# EasyEDA Pro project LEDclock_DCF77-RTC-BAT_ProPrj_2026-05-02.epro

# Schematic Schematic1
Board Name: Board1; Create Date: 2026-04-27; Page Name: P1; Project Name: LEDclock_DCF77-RTC-BAT; Schematic Name: Schematic1; Update Date: 2026-04-29; Company: EasyEDA.com; Page Size: A4; Version: V1.0
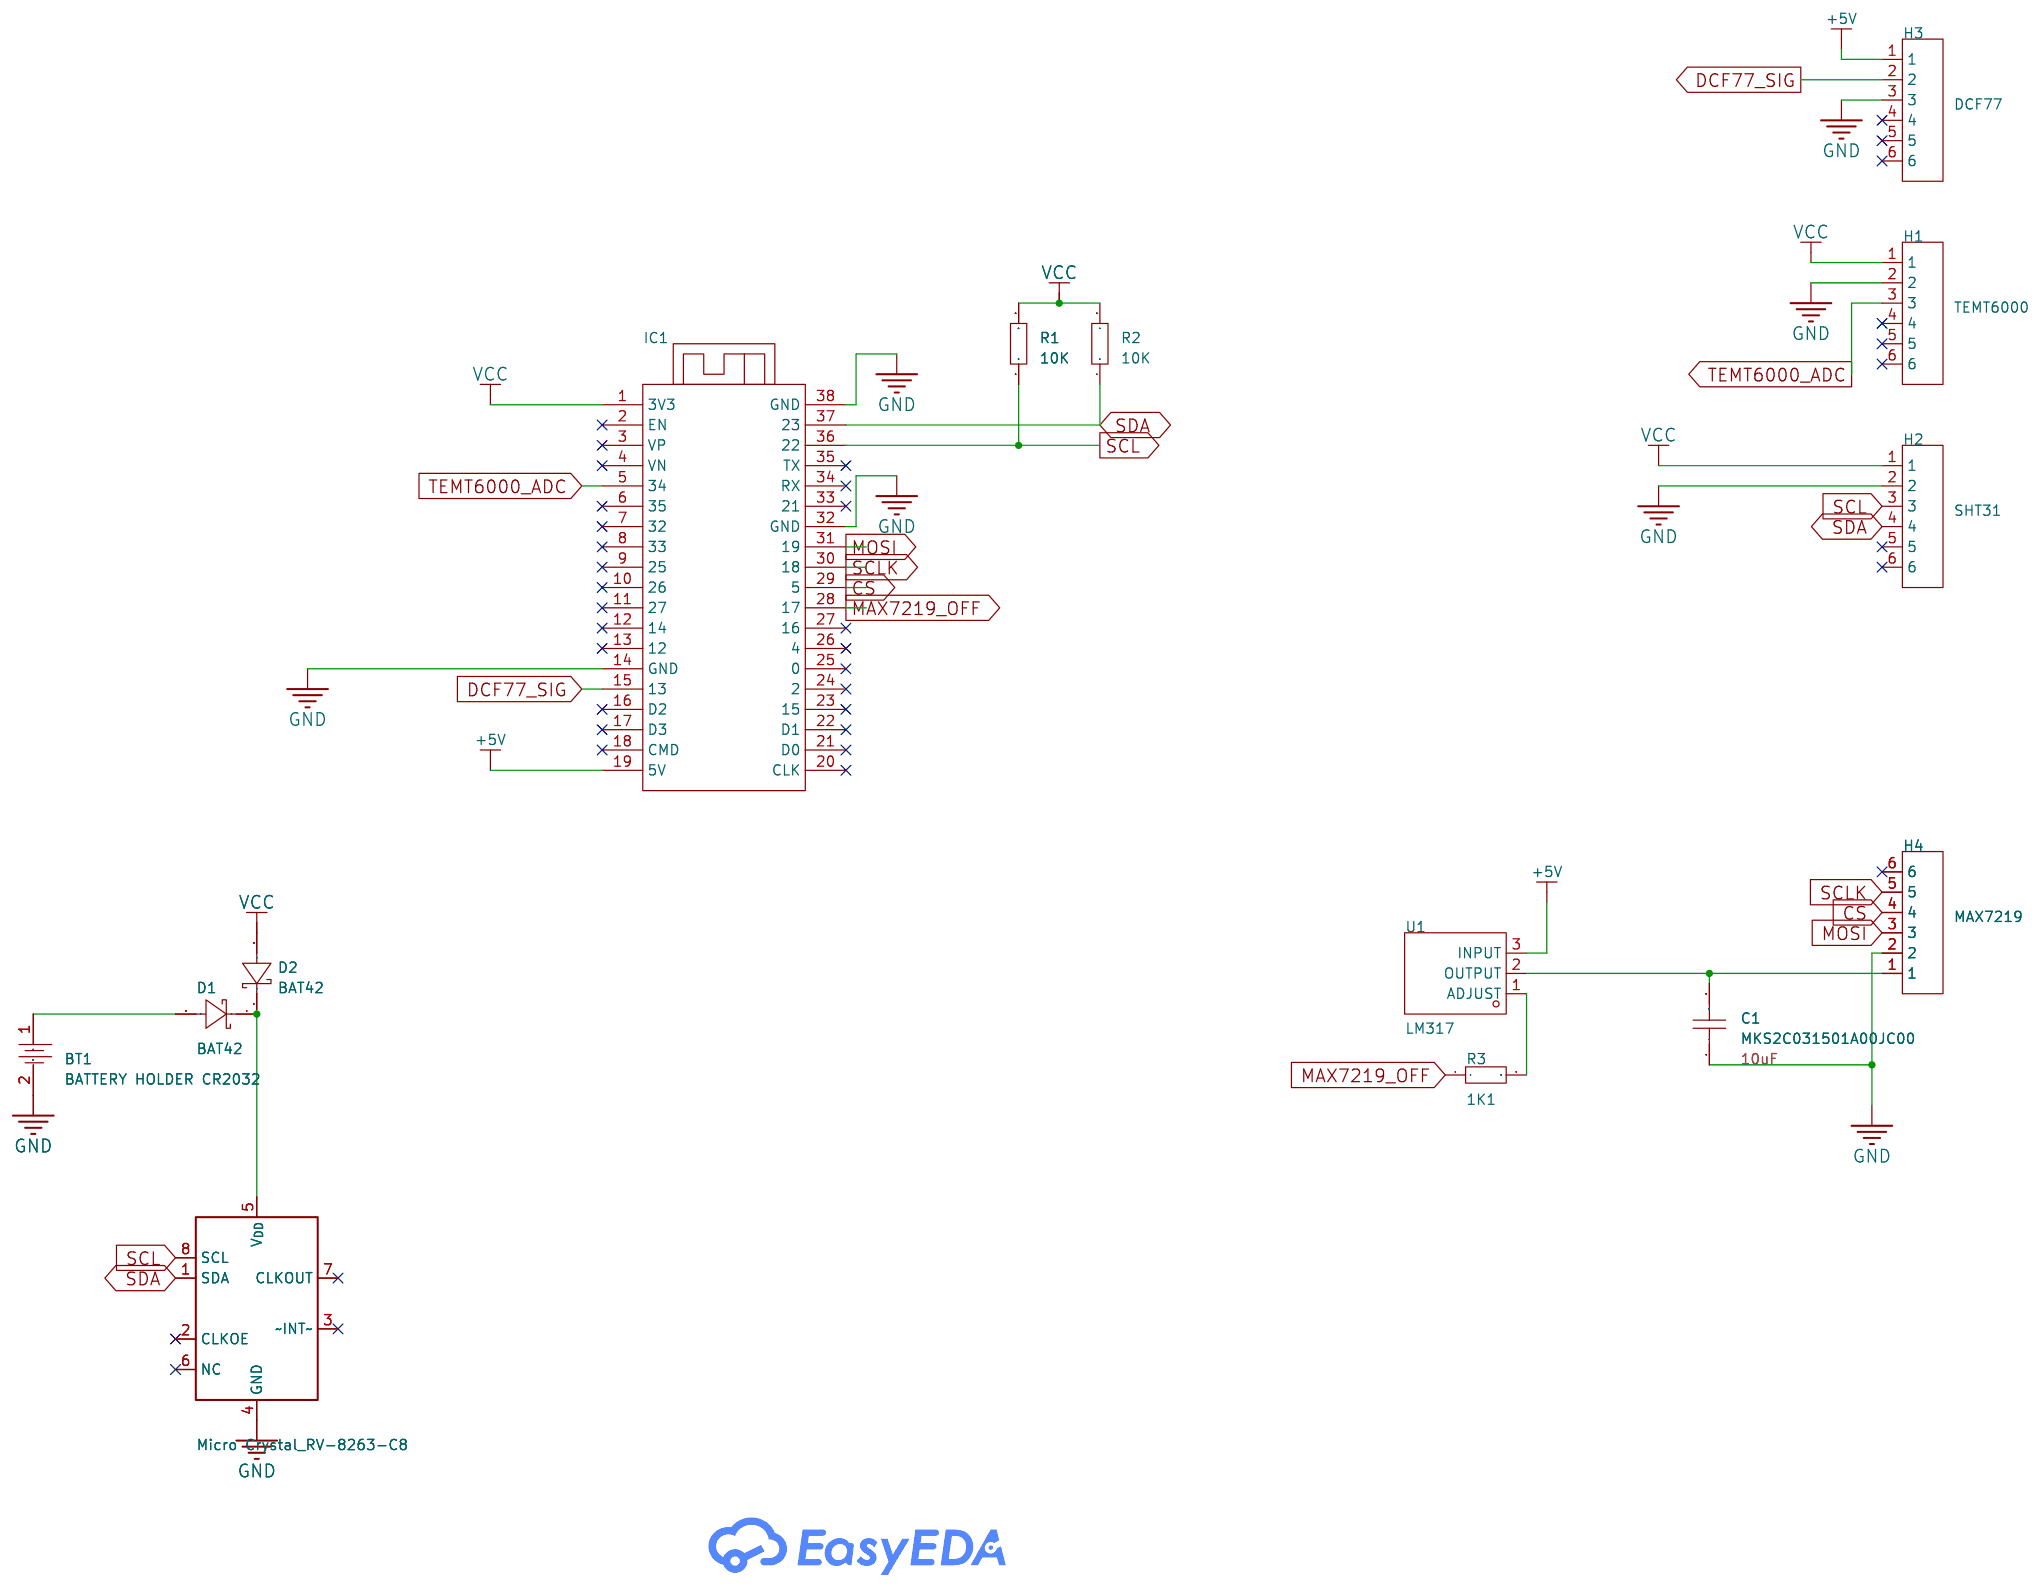
[diagram p0: schematic sheet]

## Parts
BT1  BATTERY HOLDER CR2032  [BAT-TH_FBA25014-S02B2004K]
C1  MKS2C031501A00JC00  [CAP-TH_L7.2-W2.5-P5.00-D0.5-1]
D1  BAT42  [DO-35_BD1.8-L4.1-P7.00-D0.5-RD]
D2  BAT42  [DO-35_BD1.8-L4.1-P7.00-D0.5-RD]
H1  TEMT6000  [CONN-TH_SSQ-106-03-G-S]
H2  SHT31  [CONN-TH_SSQ-106-03-G-S]
H3  DCF77  [CONN-TH_SSQ-106-03-G-S]
H4  MAX7219  [CONN-TH_SSQ-106-03-G-S]
IC1  -  [ESP32 WROOM devkit]
IC2  RV-8263-C8  [Micro Crystal:RV-8263-C8]
R1  10K  [HDR-TH_2P-P5.08_12251103CNSNU000001]
R2  10K  [HDR-TH_2P-P5.08_12251103CNSNU000001]
R3  1K1  [HDR-TH_2P-P5.08_12251103CNSNU000001]
U1  LM317  [TO-220-3_L9.9-W4.5-P2.54-L-1]

## Library data of the parts
BT1 = FBA25014-S02B2004K: Connector Type:Battery Holder Battery Type:- Operating Temperature:-40℃~+85℃ Operating Temperature:-40℃~+85℃; Supplier Part: C2833828; Manufacturer: TXGA(特思嘉); Supplier Footprint: 插件; JLCPCB Part Class: Extended Part; Datasheet: https://item.szlcsc.com/datasheet/FBA25014-S02B2004K/2995292.html; Supplier: LCSC; Connector Type: Battery Holder; Operating Temperature: -40℃~+85℃
C1 = MKS2C031501A00JC00: Supplier Part: C7420631; Manufacturer: WIMA; Supplier Footprint: CAP-TH; JLCPCB Part Class: Extended Part; Datasheet: https://item.szlcsc.com/datasheet/MKS2C031501A00JC00/8399199.html; Supplier: LCSC; Capacitance: 10uF
D1 D2 = BAT42: Diode Configuration:Independent Voltage - Forward(Vf@If):650mV@50mA Voltage - DC Reverse(Vr):30V Current - Rectified:200mA Reverse Leakage Current (Ir):500nA@25V Operating Junction Temperature Range:-65℃~+125℃ Operating Junction Temperature Range:-65℃~+12; LCSC Part Name: 电压:30V 电流:200mA; Supplier Part: C2798198; Manufacturer: ST(意法半导体); Supplier Footprint: DO-35; JLCPCB Part Class: Extended Part; Datasheet: https://item.szlcsc.com/datasheet/BAT42/2937121.html; Supplier: LCSC; Diode Configuration: Independent; Voltage - Forward(Vf@If): 650mV@50mA; Voltage - DC Reverse(Vr): 30V; Current - Rectified: 200mA; Reverse Leakage Current (Ir): 500nA@25V; Operating Junction Temperature Range: -65℃~+125℃; Non-Repetitive Peak Forward Surge Current: 4A
H1-H4 = SSQ-106-03-G-S: Holes Structure:1x6P Pitch:2.54mm Row Spacing:- Circular Hole / Square Hole:Square Hole Mounting Type:Through Hole Number of Rows:1 Number of Positions:6P Current Rating:4.7A Voltage Rating (Max):655V Holes Direction:Top Insulation Height:8.51mm Contact M; LCSC Part Name: 1x6P 间距:2.54mm 直插; Supplier Part: C3323798; Manufacturer: SAMTEC; Supplier Footprint: 插件,P=2.54mm; JLCPCB Part Class: Extended Part; Datasheet: https://item.szlcsc.com/datasheet/SSQ-106-03-G-S/3888394.html; Supplier: LCSC; Holes Structure: 1x6P; Pitch: 2.54mm; Circular Hole / Square Hole: Square Hole; Mounting Type: Through Hole; Number of Rows: 1; Number of Positions: 6P; Current Rating: 4.7A; Voltage Rating (Max): 655V; Holes Direction: Top; Insulation Height: 8.51mm; Contact Material: Phosphor bronze; Contact Plating: Gold; Operating Temperature: -55℃~+125℃; PIN Length: 10mm
IC1 = ESP32 WROOM defkit: https://docs.espressif.com/projects/esp-idf/en/v5.1/esp32/hw-reference/esp32/get-started-devkitc.html
IC2 = Micro Crystal_RV-8263-C8: Attribute1: IC507; Datasheet: https://www.microcrystal.com/fileadmin/Media/Products/RTC/Datasheet/RV-8263-C8.pdf; manf: Micro Crystal; manf#: RV-8263-C8 32.768kHz-20PPM-TA-QA; mouser#: 428-204291-MC01; User doc link: https://www.microcrystal.com/fileadmin/Media/Products/RTC/Datasheet/RV-8263-C8.pdf
R1-R3 = Res_0603: Supplier Footprint: 0603
U1 = LM317_C7463411: Output Type:Adjustable Voltage - Supply:40V Output Voltage:1.2V~37V Output Voltage:1.2V~37V Output Current:1.5A Power Supply Rejection Ratio (PSRR):75dB@(120Hz) standby current:46uA Features:Short Circuit Protection；Over Current Protection；Over Temperatur; LCSC Part Name: 1.2V~37V 1.5A 40V; Supplier Part: C7463411; Manufacturer: IDCHIP(英锐芯); Supplier Footprint: TO-220; JLCPCB Part Class: Extended Part; Datasheet: https://item.szlcsc.com/datasheet/LM317/8498176.html; Supplier: LCSC; Output Type: Adjustable; Voltage - Supply: 40V; Output Voltage: 1.2V~37V; Output Current: 1.5A; Power Supply Rejection Ratio (PSRR): 75dB@(120Hz); standby current: 46uA; Features: Short Circuit Protection；Over Current Protection；Over Temperature Protection; Operating Temperature: 0℃~+125℃; Output Configuration: Positive; Number of Outputs: 1

## Nets
+5V: H3.1 IC1.19(5V) U1.3(INPUT)
GND: BT1.2 C1.1 H1.2 H2.2 H3.3 H4.2 IC1.14(GND) IC1.32(GND) IC1.38(GND) IC2.4(GND)
VCC: D2.2(A) H1.1 H2.1 IC1.1(3V3) R1.2 R2.2
CS: H4.4 IC1.29(5)
DCF77_SIG: H3.2 IC1.15(13)
MAX7219_OFF: IC1.28(17) R3.1
MOSI: H4.3 IC1.31(19)
SCL: H2.3 IC1.36(22) IC2.8(SCL) R1.1
SCLK: H4.5 IC1.30(18)
SDA: H2.4 IC1.37(23) IC2.1(SDA) R2.1
TEMT6000_ADC: H1.3 IC1.5(34)
$1N1771: BT1.1 D1.2(A)
$1N2344: C1.2 H4.1 U1.2(OUTPUT)
$1N3344: D1.1(K) D2.1(K) IC2.5(V_{DD})
$1N4735: R3.2 U1.1(ADJUST)

Not connected (* = marked no-connect by the designer): H1 4* 5* 6*; H2 5* 6*; H3 4* 5* 6*; H4 6*; IC1 2(EN)* 3(VP)* 4(VN)* 6(35)* 7(32)* 8(33)* 9(25)* 10(26)* 11(27)* 12(14)* 13(12)* 16(D2)* 17(D3)* 18(CMD)* 20(CLK)* 21(D0)* 22(D1)* 23(15)* 24(2)* 25(0)* 26(4)* 27(16)* 33(21)* 34(RX)* 35(TX)*; IC2 2(CLKOE)* 3(~INT~)* 6(NC)* 7(CLKOUT)*

# Board PCB1 - Europlatine
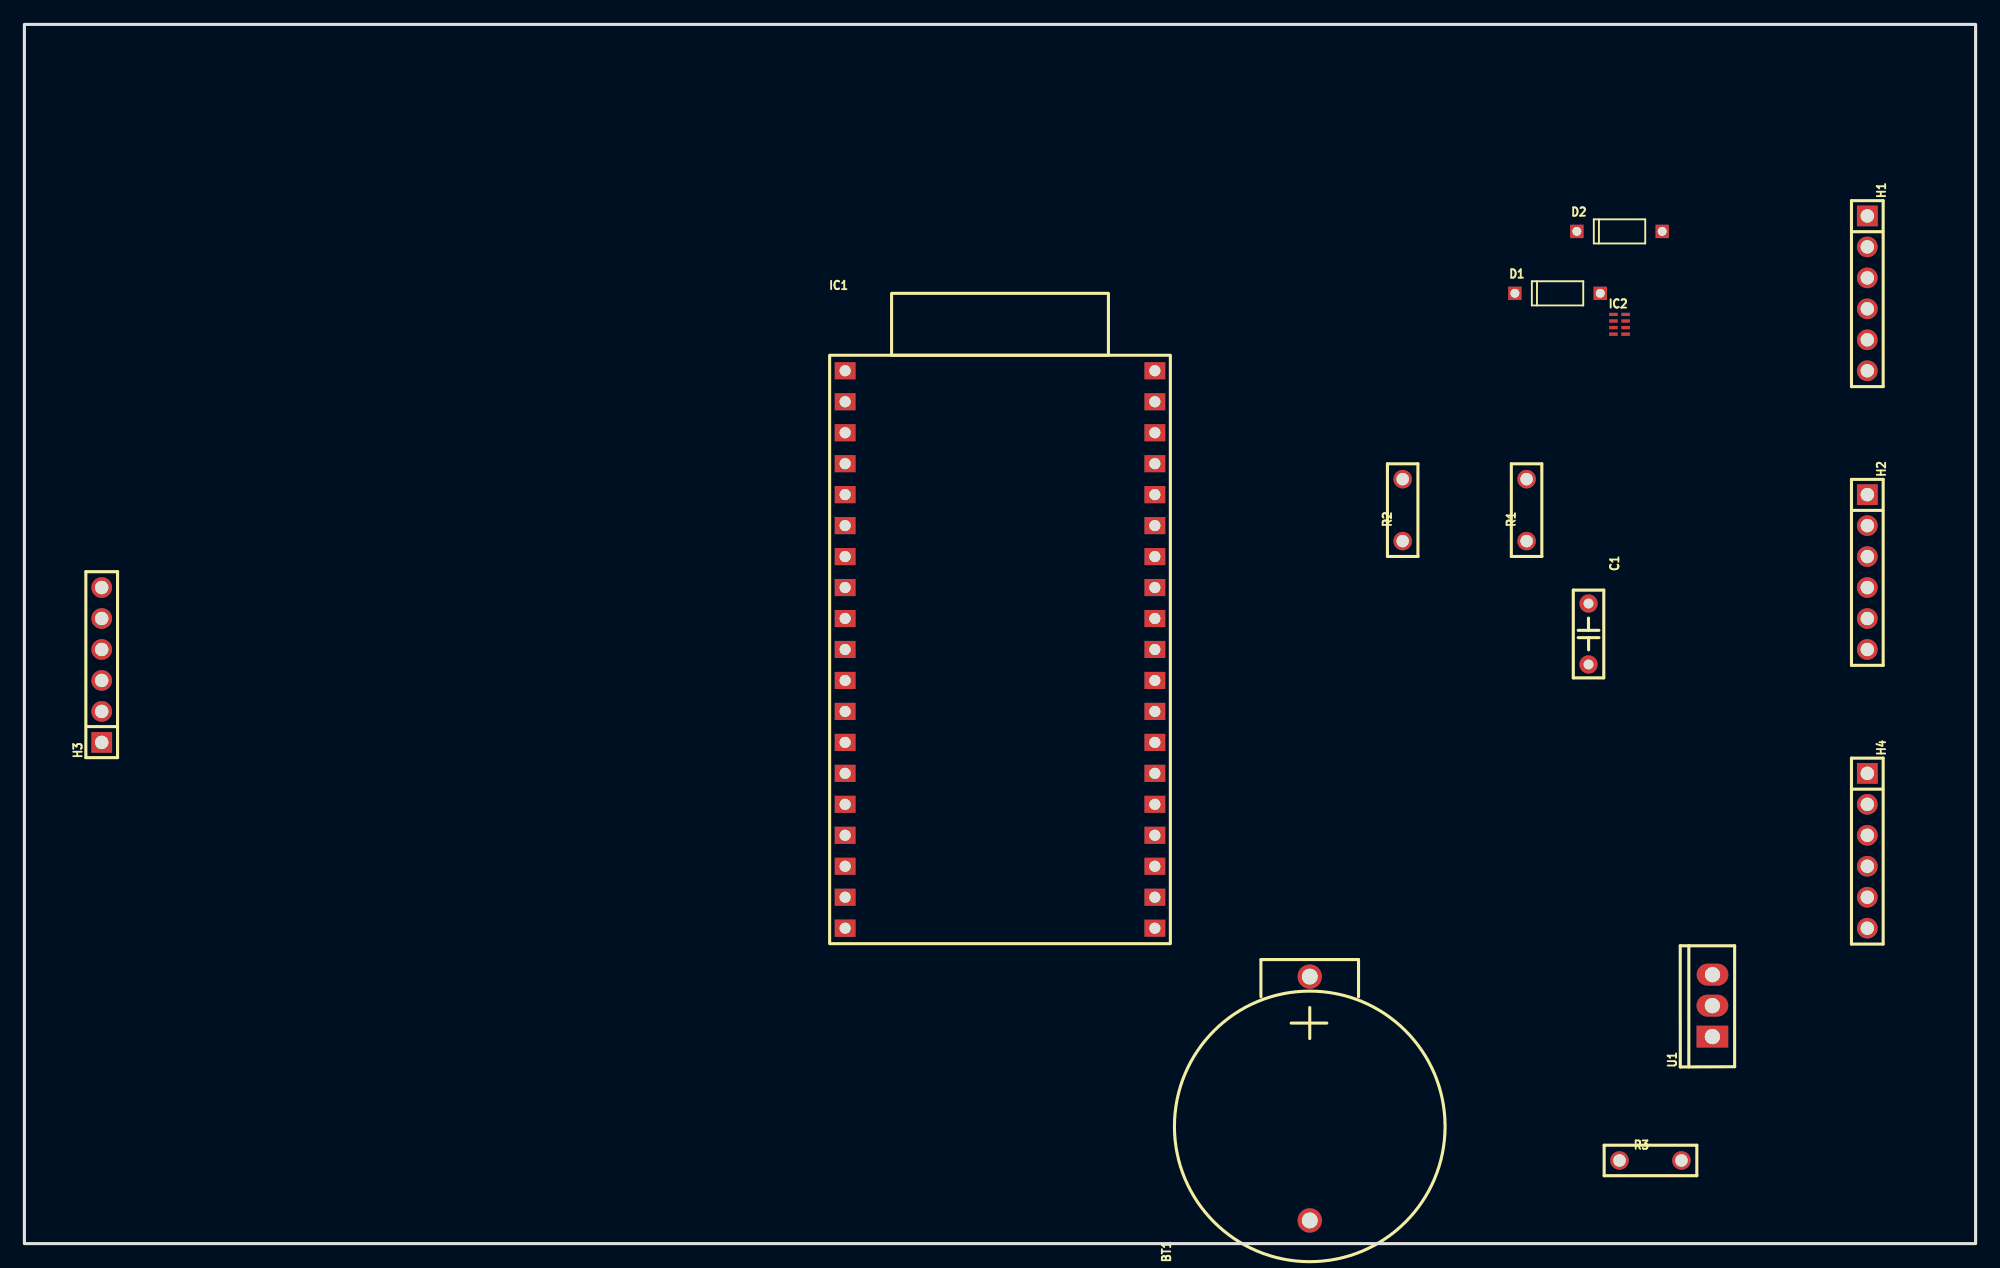
[diagram p1: board, top side]
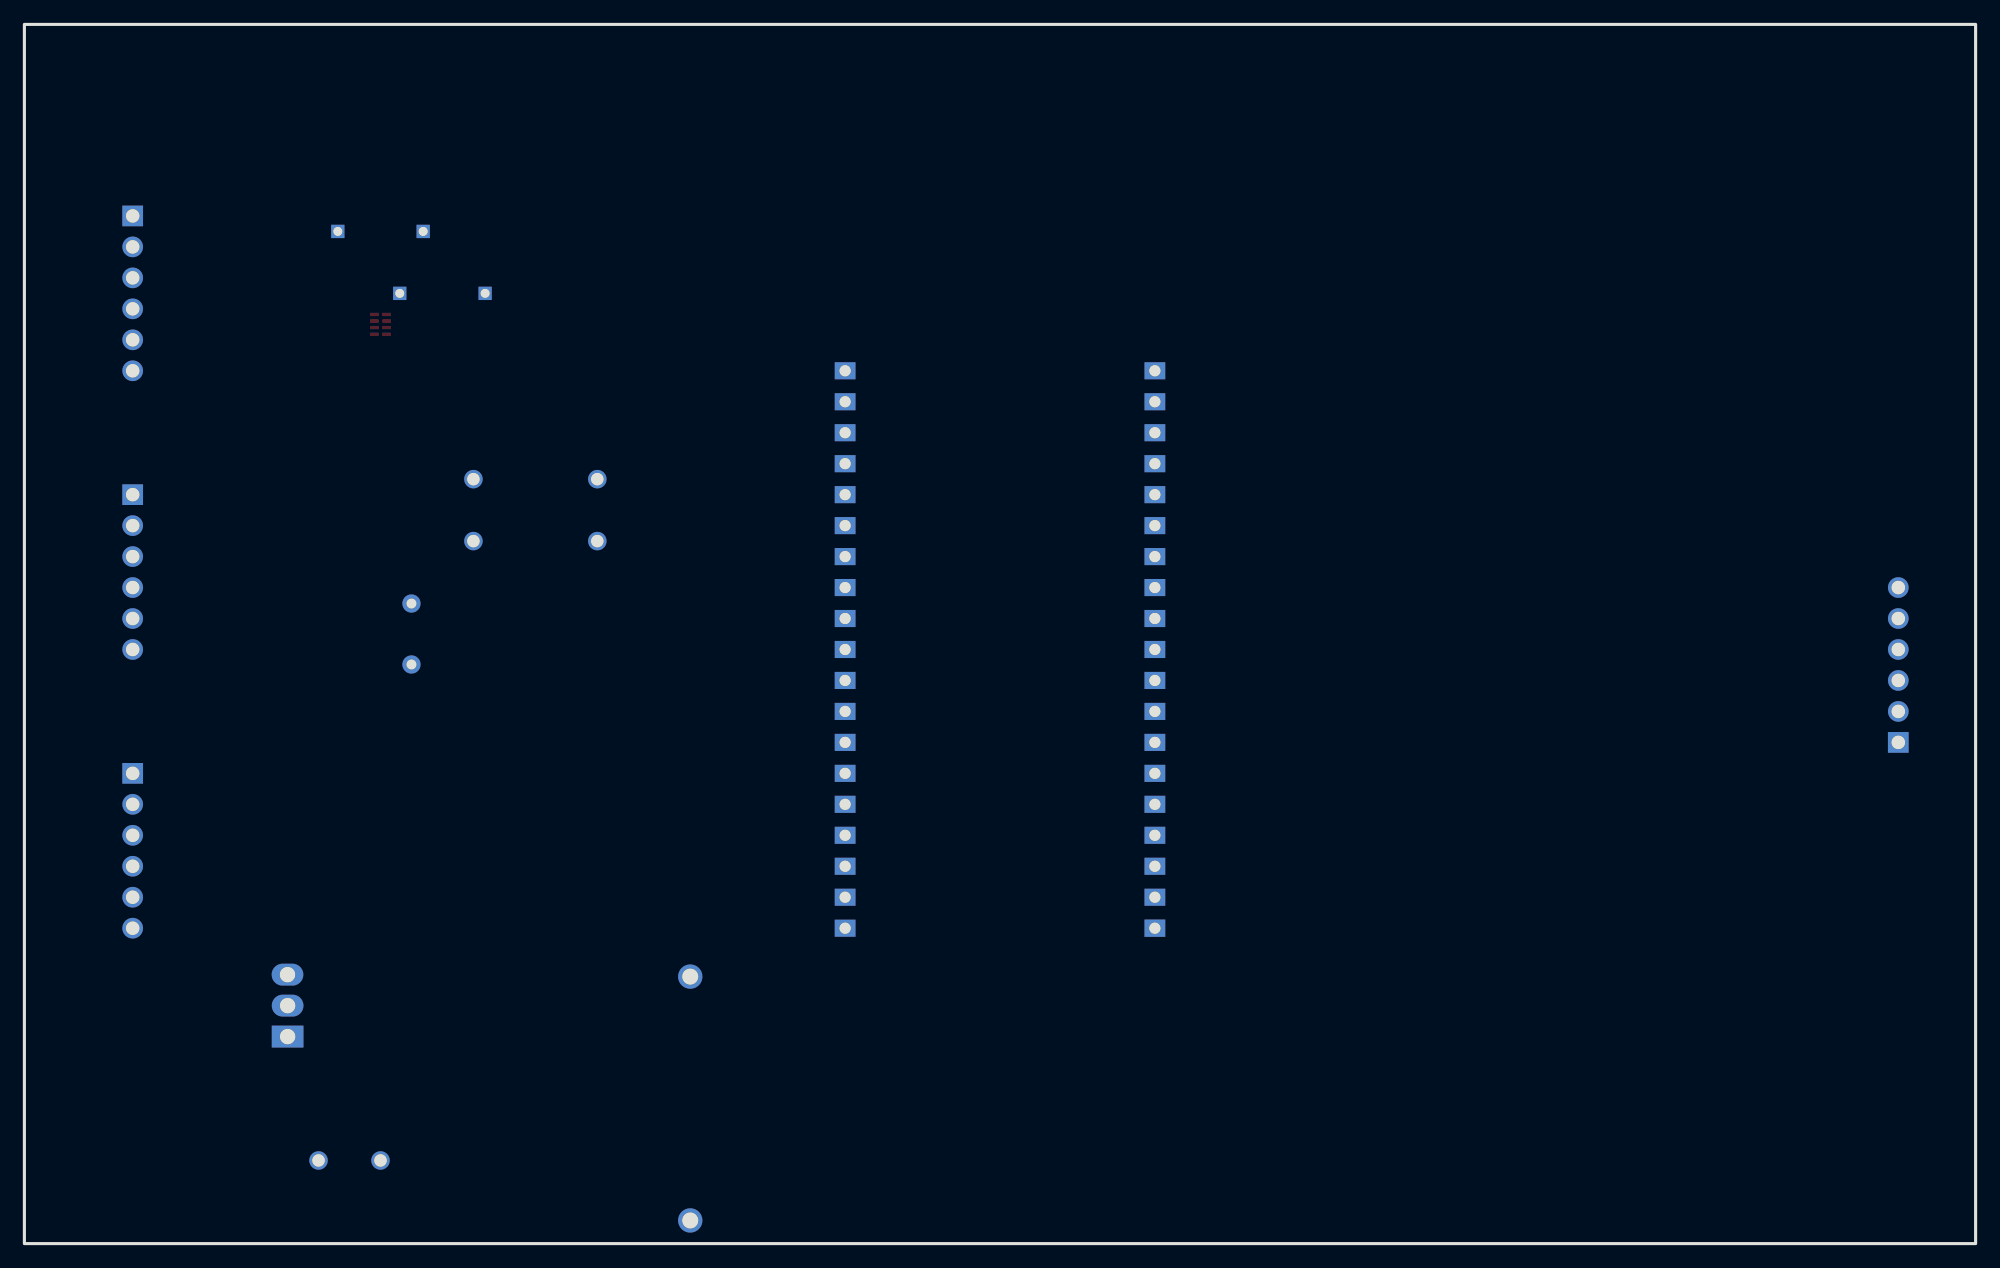
[diagram p2: board, bottom side, seen from below]

Outline 160 x 100 mm; copper layers: Top Layer, Bottom Layer. Coordinates in mm from the lower left corner of the outline.
Outline path: rectangle 0,100 160,0
Stack: Top Layer 0.035mm / Dielectric1 1.51mm FR4 er 4.5 / Bottom Layer 0.035mm

## Design rules (mm)
template: JLCPCB Capability(Two Layers Board)
spacing copperThickness1oz (default): track to track 0.102, other pairs 0.152 to 0.3
spacing copperThickness2oz: track to track 0.203, other pairs 0.152 to 0.3
track width copperThickness1oz (default): min 0.127, default 0.254, max 2.54
track width copperThickness2oz: min 0.203, default 0.254, max 2.54
differential pair differentialPair (default): width min 0.127, default 0.254, max 2.54; gap min 0.152, default 0.152
via viaSize (default): diameter min 0.5, default 0.61, max 10; hole min 0.3, default 0.305, max 6.3

## Placement (name value [footprint] x y rotation side)
BT1  BATTERY HOLDER CR2032  [BAT-TH_FBA25014-S02B2004K]  105.4 11.9 90 top
C1  MKS2C031501A00JC00  [CAP-TH_L7.2-W2.5-P5.00-D0.5-1]  128.26 50 270 top
D1  BAT42  [DO-35_BD1.8-L4.1-P7.00-D0.5-RD]  125.72 77.94 0 top
D2  BAT42  [DO-35_BD1.8-L4.1-P7.00-D0.5-RD]  130.8 83.02 0 top
H1  TEMT6000  [CONN-TH_SSQ-106-03-G-S]  151.12 77.94 270 top
H2  SHT31  [CONN-TH_SSQ-106-03-G-S]  151.12 55.08 270 top
H3  DCF77  [CONN-TH_SSQ-106-03-G-S]  6.34 47.46 90 top
H4  MAX7219  [CONN-TH_SSQ-106-03-G-S]  151.12 32.22 270 top
IC1  -  [ESP32 WROOM devkit]  80 47.46 0 top
IC2  RV-8263-C8  [Micro Crystal:RV-8263-C8]  130.8 75.4 0 top
R1  10K  [HDR-TH_2P-P5.08_12251103CNSNU000001]  123.18 60.16 90 top
R2  10K  [HDR-TH_2P-P5.08_12251103CNSNU000001]  113.02 60.16 90 top
R3  1K1  [HDR-TH_2P-P5.08_12251103CNSNU000001]  133.34 6.82 0 top
U1  LM317  [TO-220-3_L9.9-W4.5-P2.54-L-1]  138.42 19.52 90 top

## Footprints (pads in the part's own frame, mm; a bottom-side part is the same pattern mirrored in y, then rotated)
BAT-TH_FBA25014-S02B2004K
  round 2 hole 1.3: 1(10,0) 2(-10,0)
CAP-TH_L7.2-W2.5-P5.00-D0.5-1
  round 1.5 hole 0.8: 1(-2.5,0) 2(2.5,0)
CONN-TH_SSQ-106-03-G-S
  rect 1.7x1.7 hole 1.1: 1(-6.35,0)
  round 1.7 hole 1.1: 2(-3.81,0) 3(-1.27,0) 4(1.27,0) 5(3.81,0) 6(6.35,0)
DO-35_BD1.8-L4.1-P7.00-D0.5-RD
  rect 1.095x1.095 hole 0.73: 1(-3.5,0) 2(3.5,0)
ESP32 WROOM devkit
  rect 1.707x1.404 hole 0.914x0.848: 1(-12.7,24.13) 2(-12.7,21.59) 3(-12.7,19.05) 4(-12.7,16.51) 5(-12.7,13.97) 6(-12.7,11.43) 7(-12.7,8.89) 8(-12.7,6.35) 9(-12.7,3.81) 10(-12.7,1.27) 11(-12.7,-1.27) 12(-12.7,-3.81) 13(-12.7,-6.35) 14(-12.7,-8.89) 15(-12.7,-11.43) 16(-12.7,-13.97) 17(-12.7,-16.51) 18(-12.7,-19.05) 20(12.7,-21.59) 21(12.7,-19.05) 22(12.7,-16.51) 23(12.7,-13.97) 24(12.7,-11.43) 25(12.7,-8.89) 26(12.7,-6.35) 27(12.7,-3.81) 28(12.7,-1.27) 29(12.7,1.27) 30(12.7,3.81) 31(12.7,6.35) 32(12.7,8.89) 33(12.7,11.43) 34(12.7,13.97) 35(12.7,16.51) 36(12.7,19.05) 37(12.7,21.59) 38(12.7,24.13)
  rect 1.707x1.422 hole 0.914x0.848: 19(-12.7,-21.59)
HDR-TH_2P-P5.08_12251103CNSNU000001
  round 1.52 hole 1.02: 1(-2.54,0) 2(2.54,0)
Micro Crystal:RV-8263-C8
  rect 0.7x0.27 smd: 1(-0.5,0.81) 2(-0.5,0.27) 3(-0.5,-0.27) 4(-0.5,-0.81) 5(0.5,-0.81) 6(0.5,-0.27) 7(0.5,0.27) 8(0.5,0.81)
TO-220-3_L9.9-W4.5-P2.54-L-1
  rect 1.8x2.6 hole 1.25: 1(-2.54,0.005)
  oval 1.8x2.6 hole 1.25: 2(0,0.005) 3(2.54,-0.005)

## Nets
As in the schematic.

Pads without a net: H1 4 5 6; H2 5 6; H3 4 5 6; H4 6; IC1 2 3 4 6 7 8 9 10 11 12 13 16 17 18 20 21 22 23 24 25 26 27 33 34 35; IC2 2 3 6 7
